# EasyEDA Pro project ProPrj_ch32v305_pico.epro, board PCB1_rev1
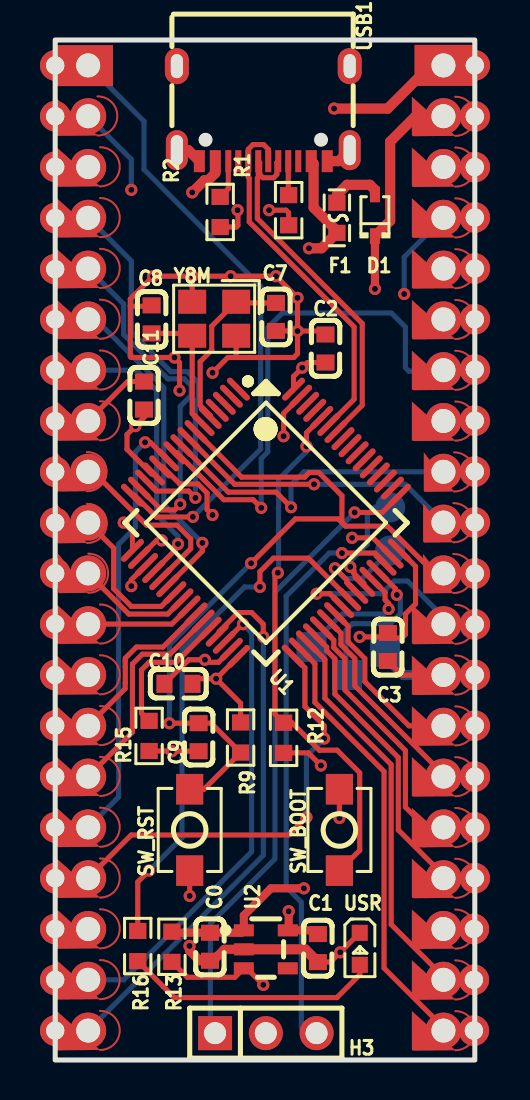
[diagram p11: board, top side]
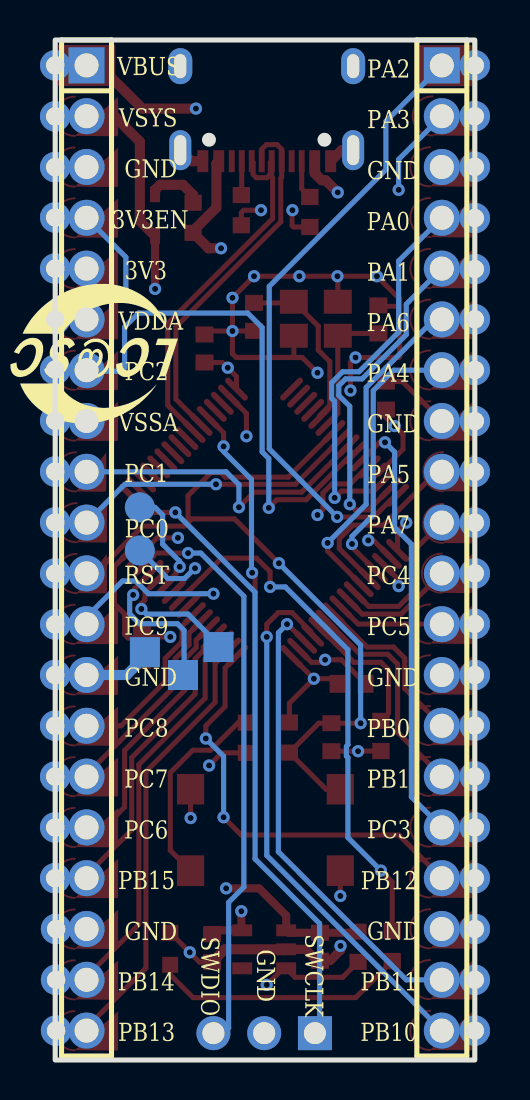
[diagram p12: board, bottom side, seen from below]

Outline 21 x 51 mm; copper layers: Top Layer, Inner1, Inner2, Bottom Layer. Coordinates in mm from the lower left corner of the outline.
Outline path: rectangle 0,51 21,0
Stack: Top Layer 0.035mm Outer layer thickness 1oz / Dielectric1 0.2104mm 7628 RC49% 8.6mil / Inner1 0.0152mm Inner layer thickness / Dielectric2 1.065mm 1.1mm H/HOZ Copper / Inner2 0.0152mm Inner layer thickness / Dielectric3 0.2104mm 7628 RC49% 8.6mil / Bottom Layer 0.035mm Outer layer thickness 1oz

## Design rules (mm)
net D-: DP1
net D+: DP1
spacing copperThickness1oz: track to track 0.102, other pairs 0.152 to 0.3
spacing copperThickness2oz: track to track 0.203, other pairs 0.152 to 0.3
spacing nothing (default): track to track 0.102, other pairs 0 to 0.3
track width copperThickness1oz (default): min 0.127, default 0.254, max 2.54
track width copperThickness2oz: min 0.203, default 0.254, max 2.54
track width powerRail: min 0.254, default 0.406, max 2.54
differential pair differentialPair (default): width min 0.127, default 0.254, max 2.54; gap min 0.152, default 0.152
net GND uses copperRegion, copperThickness1oz
net VSYS uses powerRail
net VBUS uses powerRail

## Placement (name value [footprint] x y rotation side)
C0  2.2uF  [C0603]  7.75 5.66 90 top
C1  2.2uF  [C0603]  13.15 5.6 90 top
C2  0.1uF  [C0603]  13.53 35.57 270 top
C3  0.1uF  [C0603]  16.65 20.65 90 top
C7  10pF  [C0603]  11.05 37.15 270 top
C8  10pF  [C0603]  4.83 37.03 270 top
C9  1uF  [C0603]  7.18 16.14 270 top
C10  0.1uF  [C0603]  6.17 18.81 0 top
C11  0.1uF  [C0603]  4.45 33.22 270 top
D1  B5819WS  [SOD-323_L1.7-W1.3-LS2.5-FD]  16 42.24 270 top
F1  SMD0603-050-12  [F0603]  14.1 42.11 90 top
H1  -  [HDR-TH_20P-P2.54-V-M-1]  1.65 25.6 270 bottom
H2  -  [HDR-TH_20P-P2.54-V-M-1]  19.43 25.6 270 bottom
H3  -  [HDR-TH_3P-P2.54-V-M]  10.54 1.34 0 top
NOREF  -  [Pad_e74]  1.65 19.26 0 top
NOREF#2  -  [Pad_e59]  21 39.57 0 top
NOREF#3  -  [Pad_e34]  0 24.33 0 top
NOREF#4  -  [Pad_e35]  0 21.81 0 top
NOREF#5  -  [Pad_e56]  21 31.97 0 top
NOREF#6  -  [Pad_e26]  0 44.66 0 top
NOREF#7  -  [Pad_e44]  20.96 1.47 0 top
NOREF#8  -  [Pad_e79]  1.65 6.56 0 top
NOREF#9  -  [Pad_e97]  19.43 1.46 180 top
NOREF#10  -  [Pad_e45]  20.96 4.01 0 top
NOREF#11  -  [Pad_e31]  0 31.94 0 top
NOREF#12  -  [Pad_e93]  19.43 11.62 180 top
NOREF#13  -  [Pad_e39]  0 11.63 0 top
NOREF#14  -  [Pad_e62]  21 47.18 0 top
NOREF#15  -  [Pad_e30]  0 34.5 0 top
NOREF#16  -  [Pad_e61]  21 44.64 0 top
NOREF#17  -  [Pad_e83]  19.43 44.64 180 top
NOREF#18  -  [Pad_e103]  19.66 24.32 180 top
NOREF#19  -  [Pad_e38]  0 14.18 0 top
NOREF#20  -  [Pad_e70]  1.65 34.5 0 top
NOREF#21  -  [Pad_e98]  19.43 49.73 180 top
NOREF#22  -  [Pad_e60]  21 42.13 0 top
NOREF#23  -  [Pad_e99]  1.33 26.83 0 top
NOREF#24  -  [Pad_e47]  21 9.09 0 top
NOREF#25  -  [Pad_e54]  21 26.88 0 top
NOREF#26  -  [Pad_e64]  1.45 49.72 0 top
NOREF#27  -  [Pad_e80]  1.65 4.02 0 top
NOREF#28  -  [Pad_e869]  16.76 25.47 0 top
NOREF#29  -  [Pad_e78]  1.65 9.1 0 top
NOREF#30  -  [Pad_e50]  21 16.72 0 top
NOREF#31  -  [Pad_e52]  21 21.78 0 top
NOREF#32  -  [Pad_e868]  16.76 27.63 0 top
NOREF#33  -  [Pad_e40]  0 9.09 0 top
NOREF#34  -  [Pad_e82]  19.43 47.18 180 top
NOREF#35  -  [Pad_e42]  0 4.01 0 top
NOREF#36  -  [Pad_e81]  1.65 1.48 0 top
NOREF#37  -  [Pad_e43]  0 1.47 0 top
NOREF#38  -  [Pad_e36]  0 19.25 0 top
NOREF#39  -  [Pad_e91]  19.43 16.7 180 top
NOREF#40  -  [Pad_e87]  19.43 34.48 180 top
NOREF#41  -  [Pad_e65]  1.53 47.2 0 top
NOREF#42  -  [Pad_e76]  1.65 14.18 0 top
NOREF#43  -  [Pad_e55]  21 29.42 0 top
NOREF#44  -  [Pad_e102]  19.66 26.86 180 top
NOREF#45  -  [Pad_e73]  1.65 21.8 0 top
NOREF#46  -  [Pad_e33]  0 26.87 0 top
NOREF#47  -  [Pad_e68]  1.65 39.58 0 top
NOREF#48  -  [Pad_e29]  0 37.03 0 top
NOREF#49  -  [Pad_e95]  19.43 6.54 180 top
NOREF#50  -  [Pad_e46]  20.96 6.55 0 top
NOREF#51  -  [Pad_e77]  1.65 11.64 0 top
NOREF#52  -  [Pad_e53]  21 24.32 0 top
NOREF#53  -  [Pad_e90]  19.43 19.24 180 top
NOREF#54  -  [Pad_e57]  21 34.52 0 top
NOREF#55  -  [Pad_e51]  21 19.25 0 top
NOREF#56  -  [Pad_e92]  19.43 14.16 180 top
NOREF#57  -  [Pad_e84]  19.43 42.1 180 top
NOREF#58  -  [Pad_e94]  19.43 9.08 180 top
NOREF#59  -  [Pad_e85]  19.43 39.56 180 top
NOREF#60  -  [Pad_e75]  1.65 16.72 0 top
NOREF#61  -  [Pad_e100]  1.4 24.34 0 top
NOREF#62  -  [Pad_e96]  19.43 4 180 top
NOREF#63  -  [Pad_e86]  19.43 37.02 180 top
NOREF#64  -  [Pad_e89]  19.43 21.78 180 top
NOREF#65  -  [Pad_e41]  0 6.55 0 top
NOREF#66  -  [Pad_e820]  16.51 20.39 0 top
NOREF#67  -  [Pad_e24]  0 49.73 0 top
NOREF#68  -  [Pad_e101]  19.7 29.4 180 top
NOREF#69  -  [Pad_e28]  0 39.55 0 top
NOREF#70  -  [Pad_e818]  12.83 20.65 0 top
NOREF#71  -  [Pad_e37]  0 16.72 0 top
NOREF#72  -  [Pad_e58]  21 37.04 0 top
NOREF#73  -  [Pad_e25]  0 47.19 0 top
NOREF#74  -  [Pad_e71]  1.65 31.96 0 top
NOREF#75  -  [Pad_e69]  1.65 37.04 0 top
NOREF#76  -  [Pad_e72]  1.32 29.42 0 top
NOREF#77  -  [Pad_e48]  21 11.63 0 top
NOREF#78  -  [Pad_e27]  0 42.1 0 top
NOREF#79  -  [Pad_e819]  14.6 19.25 0 top
NOREF#80  -  [Pad_e67]  1.65 42.12 0 top
NOREF#81  -  [Pad_e66]  1.65 44.66 0 top
NOREF#82  -  [Pad_e88]  19.43 31.94 180 top
NOREF#83  -  [Pad_e49]  21 14.17 0 top
NOREF#84  -  [Pad_e63]  21 49.73 0 top
NOREF#85  -  [Pad_e32]  0 29.41 0 top
R1  5.1k  [R0603]  11.68 42.49 270 top
R2  5.1k  [R0603]  8.26 42.4 270 top
R9  10k  [R0603]  9.28 16.12 90 top
R12  10k  [R0603]  11.43 16.11 90 top
R13  100K  [R0603]  5.84 5.66 270 top
R15  10k  [R0603]  4.7 16.2 90 top
R16  1K  [R0603]  4.13 5.7 90 top
SW_BOOT  -  [Key_SMD_3x4x2]  14.22 11.5 90 top
SW_RST  -  [Key_SMD_3x4x2]  6.73 11.5 90 top
U1  CH32V305RBT6  [LQFP-64_L10.0-W10.0-P0.50-LS12.0-BL]  10.54 26.87 225 top
U2  AP2112K-3.3TRG1  [SOT-23-5_L2.9-W1.6-P0.95-LS2.8-BR]  10.54 5.53 180 top
USB1  TYPE-C 16PIN 2MD(073)  [USB-C-SMD_TYPE-C-16PIN-2MD-073]  10.41 47.32 180 top
USR  -  [LED_0603]  15.25 5.51 270 top
Y8M  8MHz  [CRYSTAL-SMD_4P-L3.2-W2.5-BL]  7.96 37.06 180 top

## Footprints (pads in the part's own frame, mm; a bottom-side part is the same pattern mirrored in y, then rotated)
C0603
  rect 0.8x0.9 smd: 1(-0.7,0) 2(0.7,0)
CRYSTAL-SMD_4P-L3.2-W2.5-BL
  rect 1.4x1.2 smd: 1(-1.1,-0.85) 2(1.1,-0.85) 3(1.1,0.85) 4(-1.1,0.85)
F0603
  rect 0.806x0.864 smd: 1(-0.753,0) 2(0.753,0)
HDR-TH_3P-P2.54-V-M
  rect 1.7x1.7 hole 1.1: 1(-2.54,0)
  round 1.7 hole 1.1: 2(0,0) 3(2.54,0)
HDR-TH_20P-P2.54-V-M-1
  rect 1.8x1.8 hole 1.2: 1(-24.13,0)
  round 1.8 hole 1.2: 2(-21.59,0) 3(-19.05,0) 4(-16.51,0) 5(-13.97,0) 6(-11.43,0) 7(-8.89,0) 8(-6.35,0) 9(-3.81,0) 10(-1.27,0) 11(1.27,0) 12(3.81,0) 13(6.35,0) 14(8.89,0) 15(11.43,0) 16(13.97,0) 17(16.51,0) 18(19.05,0) 19(21.59,0) 20(24.13,0)
Key_SMD_3x4x2
  rect 1.53x1.36 smd: 1(-2.035,0) 2(2.035,0)
LED_0603
  rect 0.8x0.8 smd: 1(-0.851,-0.01) 2(0.75,-0.005)
LQFP-64_L10.0-W10.0-P0.50-LS12.0-BL
  oval 0.3x1.5 smd: 1(-3.75,-5.688) 2(-3.25,-5.688) 3(-2.75,-5.688) 4(-2.25,-5.688) 5(-1.75,-5.688) 6(-1.25,-5.688) 7(-0.75,-5.688) 8(-0.25,-5.688) 9(0.25,-5.688) 10(0.75,-5.688) 11(1.25,-5.688) 12(1.75,-5.688) 13(2.25,-5.688) 14(2.75,-5.688) 15(3.25,-5.688) 16(3.75,-5.688) 33(3.75,5.688) 34(3.25,5.688) 35(2.75,5.688) 36(2.25,5.688) 37(1.75,5.688) 38(1.25,5.688) 39(0.75,5.688) 40(0.25,5.688) 41(-0.25,5.688) 42(-0.75,5.688) 43(-1.25,5.688) 44(-1.75,5.688) 45(-2.25,5.688) 46(-2.75,5.688) 47(-3.25,5.688) 48(-3.75,5.688)
  oval 1.5x0.3 smd: 17(5.7,-3.738) 18(5.7,-3.238) 19(5.7,-2.738) 20(5.7,-2.238) 21(5.7,-1.738) 22(5.7,-1.238) 23(5.7,-0.739) 24(5.7,-0.238) 25(5.7,0.262) 26(5.7,0.762) 27(5.7,1.262) 28(5.7,1.762) 29(5.7,2.261) 30(5.7,2.762) 31(5.7,3.261) 32(5.7,3.762) 49(-5.7,3.762) 50(-5.7,3.261) 51(-5.7,2.762) 52(-5.7,2.261) 53(-5.7,1.762) 54(-5.7,1.262) 55(-5.7,0.762) 56(-5.7,0.262) 57(-5.7,-0.238) 58(-5.7,-0.739) 59(-5.7,-1.238) 60(-5.7,-1.738) 61(-5.7,-2.238) 62(-5.7,-2.738) 63(-5.7,-3.238) 64(-5.7,-3.738)
Pad_e24
  round 1.524 hole 0.914: 1(0,0)
Pad_e25
  round 1.524 hole 0.914: 2(0,0)
Pad_e26
  round 1.524 hole 0.914: 3(0,0)
Pad_e27
  round 1.524 hole 0.914: 4(0,0)
Pad_e28
  round 1.524 hole 0.914: 5(0,0)
Pad_e29
  round 1.524 hole 0.914: 6(0,0)
Pad_e30
  round 1.524 hole 0.914: 7(0,0)
Pad_e31
  round 1.524 hole 0.914: 8(0,0)
Pad_e32
  round 1.524 hole 0.914: 9(0,0)
Pad_e33
  round 1.524 hole 0.914: 10(0,0)
Pad_e34
  round 1.524 hole 0.914: 11(0,0)
Pad_e35
  round 1.524 hole 0.914: 12(0,0)
Pad_e36
  round 1.524 hole 0.914: 13(0,0)
Pad_e37
  round 1.524 hole 0.914: 14(0,0)
Pad_e38
  round 1.524 hole 0.914: 15(0,0)
Pad_e39
  round 1.524 hole 0.914: 16(0,0)
Pad_e40
  round 1.524 hole 0.914: 17(0,0)
Pad_e41
  round 1.524 hole 0.914: 18(0,0)
Pad_e42
  round 1.524 hole 0.914: 19(0,0)
Pad_e43
  round 1.524 hole 0.914: 20(0,0)
Pad_e44
  round 1.524 hole 0.914: 1(0,0)
Pad_e45
  round 1.524 hole 0.914: 2(0,0)
Pad_e46
  round 1.524 hole 0.914: 3(0,0)
Pad_e47
  round 1.524 hole 0.914: 1(0,0)
Pad_e48
  round 1.524 hole 0.914: 2(0,0)
Pad_e49
  round 1.524 hole 0.914: 3(0,0)
Pad_e50
  round 1.524 hole 0.914: 4(0,0)
Pad_e51
  round 1.524 hole 0.914: 5(0,0)
Pad_e52
  round 1.524 hole 0.914: 6(0,0)
Pad_e53
  round 1.524 hole 0.914: 7(0,0)
Pad_e54
  round 1.524 hole 0.914: 8(0,0)
Pad_e55
  round 1.524 hole 0.914: 9(0,0)
Pad_e56
  round 1.524 hole 0.914: 10(0,0)
Pad_e57
  round 1.524 hole 0.914: 11(0,0)
Pad_e58
  round 1.524 hole 0.914: 12(0,0)
Pad_e59
  round 1.524 hole 0.914: 13(0,0)
Pad_e60
  round 1.524 hole 0.914: 14(0,0)
Pad_e61
  round 1.524 hole 0.914: 15(0,0)
Pad_e62
  round 1.524 hole 0.914: 16(0,0)
Pad_e63
  round 1.524 hole 0.914: 17(0,0)
Pad_e64
  custom 2.891x2.05 smd: 65(0,0)
Pad_e65
  custom 3.159x1.975 smd: 66(0,0)
Pad_e66
  custom 3.158x1.975 smd: 66(0,0)
Pad_e67
  custom 3.158x1.975 smd: 66(0,0)
Pad_e68
  custom 3.158x1.975 smd: 66(0,0)
Pad_e69
  custom 3.158x1.975 smd: 66(0,0)
Pad_e70
  custom 3.158x1.975 smd: 66(0,0)
Pad_e71
  custom 3.158x1.975 smd: 66(0,0)
Pad_e72
  custom 2.502x1.975 smd: 66(0,0)
Pad_e73
  custom 3.158x1.975 smd: 66(0,0)
Pad_e74
  custom 3.158x1.975 smd: 66(0,0)
Pad_e75
  custom 3.158x1.975 smd: 66(0,0)
Pad_e76
  custom 3.158x1.975 smd: 66(0,0)
Pad_e77
  custom 3.158x1.975 smd: 66(0,0)
Pad_e78
  custom 3.158x1.975 smd: 66(0,0)
Pad_e79
  custom 3.158x1.975 smd: 66(0,0)
Pad_e80
  custom 3.158x1.975 smd: 66(0,0)
Pad_e81
  custom 3.158x1.975 smd: 66(0,0)
Pad_e82
  custom 3.158x1.975 smd: 66(0,0)
Pad_e83
  custom 3.158x1.975 smd: 66(0,0)
Pad_e84
  custom 3.158x1.975 smd: 66(0,0)
Pad_e85
  custom 3.158x1.975 smd: 66(0,0)
Pad_e86
  custom 3.158x1.975 smd: 66(0,0)
Pad_e87
  custom 3.158x1.975 smd: 66(0,0)
Pad_e88
  custom 3.158x1.975 smd: 66(0,0)
Pad_e89
  custom 3.158x1.975 smd: 66(0,0)
Pad_e90
  custom 3.158x1.975 smd: 66(0,0)
Pad_e91
  custom 3.158x1.975 smd: 66(0,0)
Pad_e92
  custom 3.158x1.975 smd: 66(0,0)
Pad_e93
  custom 3.158x1.975 smd: 66(0,0)
Pad_e94
  custom 3.158x1.975 smd: 66(0,0)
Pad_e95
  custom 3.158x1.975 smd: 66(0,0)
Pad_e96
  custom 3.158x1.975 smd: 66(0,0)
Pad_e97
  custom 3.158x1.975 smd: 66(0,0)
Pad_e98
  custom 2.892x2.051 smd: 65(0,0)
Pad_e99
  custom 2.502x1.975 smd: 66(0,0)
Pad_e100
  custom 2.502x1.975 smd: 66(0,0)
Pad_e101
  custom 2.502x1.975 smd: 66(0,0)
Pad_e102
  custom 2.502x1.975 smd: 66(0,0)
Pad_e103
  custom 2.502x1.975 smd: 66(0,0)
Pad_e818
  rect 1.5x1.5 smd far side: TP6(0,0)
Pad_e819
  rect 1.5x1.5 smd far side: TP7(0,0)
Pad_e820
  rect 1.5x1.5 smd far side: TP8(0,0)
Pad_e868
  round 1.5 smd far side: TP9(0,0)
Pad_e869
  round 1.5 smd far side: TP10(0,0)
R0603
  rect 0.806x0.864 smd: 1(-0.753,0) 2(0.753,0)
SOD-323_L1.7-W1.3-LS2.5-FD
  rect 0.78x0.5 smd: 1(-1.04,0) 2(1.04,0)
SOT-23-5_L2.9-W1.6-P0.95-LS2.8-BR
  rect 1x0.6 smd: 1(1.1,-0.95) 2(1.1,0) 3(1.1,0.95) 4(-1.1,0.95) 5(-1.1,-0.95)
USB-C-SMD_TYPE-C-16PIN-2MD-073
  oval 1.1x2 hole 0.6x1.5: 13(-4.325,1.825) 14(4.325,1.825)
  oval 1.2x1.8 hole 0.6x1.2: 13(-4.325,-2.375) 14(4.325,-2.375)
  rect 0.55x1.1 smd: A1B12(-3.2,2.375) A4B9(-2.4,2.375) B1A12(3.2,2.375) B4A9(2.4,2.375)
  rect 0.3x1.1 smd: A5(-1.25,2.375) A6(-0.25,2.375) A7(0.25,2.375) A8(1.25,2.375) B5(1.75,2.375) B6(0.75,2.375) B7(-0.75,2.375) B8(-1.75,2.375)

## Nets
3V3_EN: H2.4 NOREF#22.14 NOREF#57.66 R13.2 U2.3
+3.3V: C1.2 C2.2 C3.2 C10.2 C11.2 H2.5 H2.6 NOREF#2.13 NOREF#59.66 NOREF#63.66 NOREF#72.12 R9.2 SW_BOOT.2 U1.13 U1.19 U1.32 U1.48 U1.64 U2.5
GND: C0.1 C1.1 C2.1 C3.1 C7.2 C8.1 C9.2 C10.1 C11.1 H1.3 H1.8 H1.13 H1.18 H2.3 H2.8 H2.13 H2.18 H3.2 NOREF.66 NOREF#5.10 NOREF#6.3 NOREF#8.66 NOREF#11.8 NOREF#16.15 NOREF#17.66 NOREF#38.13 NOREF#49.66 NOREF#50.3 NOREF#53.66 NOREF#55.5 NOREF#65.18 NOREF#66.TP8 NOREF#74.66 NOREF#81.66 NOREF#82.66 R1.2 R2.2 R12.1 R15.1 SW_RST.1 U1.12 U1.18 U1.31 U1.47 U1.63 U2.2 USB1.13 USB1.14 USB1.A1B12 USB1.B1A12 USR.1 Y8M.2 Y8M.4
VBUS: F1.1 H2.1 NOREF#21.65 NOREF#84.17 USB1.A4B9 USB1.B4A9
BOOT0: R12.2 SW_BOOT.1 U1.60
D+: U1.59 USB1.A6 USB1.B6
D-: U1.58 USB1.A7 USB1.B7
OSC_IN: C7.1 U1.5 Y8M.1
OSC_OUT: C8.2 U1.6 Y8M.3
PA0: H1.4 NOREF#78.4 NOREF#80.66 U1.14
PA1: H1.5 NOREF#47.66 NOREF#69.5 U1.15
PA2: H1.1 NOREF#26.65 NOREF#67.1 U1.16
PA3: H1.2 NOREF#41.66 NOREF#73.2 U1.17
PA4: H1.7 NOREF#15.7 NOREF#20.66 U1.20
PA5: H1.9 NOREF#76.66 NOREF#85.9 U1.21
PA6: H1.6 NOREF#48.6 NOREF#75.66 U1.22
PA7: H1.10 NOREF#23.66 NOREF#46.10 U1.23
PA8: R16.2 U1.41
PA9: NOREF#28.TP10 U1.42
PA10: NOREF#32.TP9 U1.43
PA15: U1.50
PB0: H1.14 NOREF#60.66 NOREF#71.14 U1.26
PB1: H1.15 NOREF#19.15 NOREF#42.66 U1.27
PB2: R15.2 U1.28
PB3: U1.55
PB4: U1.56
PB5: U1.57
PB8: U1.61
PB9: U1.62
PB10: H1.20 NOREF#36.66 NOREF#37.20 U1.29
PB11: H1.19 NOREF#27.66 NOREF#35.19 U1.30
PB12: H1.17 NOREF#29.66 NOREF#33.17 U1.33
PB13: H2.20 NOREF#7.1 NOREF#9.66 U1.34
PB14: H2.19 NOREF#10.2 NOREF#62.66 U1.35
PB15: H2.17 NOREF#24.1 NOREF#58.66 U1.36
PC0: H2.10 NOREF#25.8 NOREF#44.66 U1.8
PC1: H2.9 NOREF#43.9 NOREF#68.66 U1.9
PC2: H2.7 NOREF#40.66 NOREF#54.11 U1.10
PC3: H1.16 NOREF#13.16 NOREF#51.66 U1.11
PC4: H1.11 NOREF#3.11 NOREF#61.66 U1.24
PC5: H1.12 NOREF#4.12 NOREF#45.66 U1.25
PC6: H2.16 NOREF#12.66 NOREF#77.2 U1.37
PC7: H2.15 NOREF#56.66 NOREF#83.3 U1.38
PC8: H2.14 NOREF#30.4 NOREF#39.66 U1.39
PC9: H2.12 NOREF#31.6 NOREF#64.66 U1.40
PC10: U1.51
PC11: U1.52
PC12: U1.53
PC13: U1.2
PC14: U1.3
PC15: U1.4
PD2: U1.54
SWCLK: H3.1 U1.49
SWDIO: H3.3 U1.46
SYS_RST: C9.1 H2.11 NOREF#18.66 NOREF#52.7 R9.1 SW_RST.2 U1.7
USB1DM: NOREF#70.TP6 U1.44
USB1DP: NOREF#79.TP7 U1.45
VSYS: C0.2 D1.2 H2.2 NOREF#14.16 NOREF#34.66 R13.1 U2.1
$1N10: R1.1 USB1.A5
$1N11: R2.1 USB1.B5
$1N150: D1.1 F1.2
$1N168: R16.1 USR.2

Pads without a net: U1 1; U2 4; USB1 A8 B8

## Via types
v1: diameter 0.61, hole 0.305, Top Layer to Bottom Layer, 63 vias

## Routing (per net, layer and track width the routed paths; a pad name or vN(x,y) marks a point on that pad's centre or on a via; arc(x,y) is an arc through that point)
3V3_EN: length 50.9
  Top Layer w0.254: R13.2 6.61,4.14 8.99,4.14 U2.3 9.59,4.58 v1(10.41,3.76)
  Inner2 w0.254: v1(10.41,3.76) 15.75,3.76 17.78,5.79 17.78,37.98 v1(17.46,38.3)
  Bottom Layer w0.254: v1(17.46,38.3) 17.46,40.14 H2.4
+3.3V: length 91.8
  Top Layer w0.254: C11.2 4.45,32.13 v1(4.01,31.7) 3.59,31.28 3.59,30.53 4.83,29.3 4.93,29.3 ; 9.28,16.88 9.28,17.84 v1(8.05,19.06) ; v1(3.81,23.69) 3.81,24.01 U1.19 ; v1(15.24,21.16) 16.45,21.16 C3.2 16.9,21.1 17.35,21.1 17.53,21.28 17.53,22.3 18.03,22.81 18.03,24.68 17.22,25.5 ; U1.32 v1(8.05,19.06) ; v1(8.05,19.06) 6.87,19.06 ; C1.2 13.4,6.3 ; v1(14.22,12.1) SW_BOOT.2 ; C2.2 12.62,34.87 v1(12.36,34.61) 11.93,34.18 U1.64
  Top Layer w0.406: 13.4,6.3 13.21,6.48 U2.5 11.68,6.53 v1(11.68,7.44)
  Inner2 w0.254: v1(15.24,21.16) 15.11,21.03 12.7,21.03 11.68,20.01 ; v1(8.05,19.06) 11.62,19.06 11.68,19.12 ; 9.14,31.7 9.09,31.75 4.06,31.75 4.01,31.7 ; 9.14,23.82 3.94,23.82 v1(3.81,23.69) ; 11.68,11.63 11.76,11.55 12.81,11.55 13.36,12.1 v1(14.22,12.1)
  Inner2 w0.406: H2.6 18.12,38.34 18.12,39.57 ; 18.12,39.57 15.39,39.57 14.99,39.16 14.99,35.63 13.97,34.61 v1(12.36,34.61) 9.72,34.61 9.14,34.04 9.14,23.82 11.68,21.28 v1(11.68,7.44) ; 18.12,39.57 H2.5
GND: length 76
  Top Layer w0.254: 9.01,35.12 8.64,35.12 v1(7.87,34.36) ; 9.01,35.12 11.94,35.12 12.13,35.32 v1(12.13,36.45) ; 9.01,35.12 9.06,35.17 9.06,36.21 ; v1(13.3,14.72) 12.67,15.36 R12.1 ; C7.2 12.12,36.45 v1(12.13,36.45) ; R15.1 5.83,15.45 v1(5.84,15.44) C9.2 ; v1(12.13,36.45) v1(12.13,38.11) v1(11.05,39.19) v1(8.78,39.19) 6.72,39.19 ; v1(12.13,36.45) 13.35,36.45 C2.1 ; NOREF#53.66 17.36,19.24 C3.1 ; 16.86,25.15 15.9,26.11 v1(14.86,26.11) ; v1(11.43,31.19) 11.43,32.33 12.28,33.18 U1.63 ; v1(5.33,25.98) 5.07,25.98 4.22,25.13 ; H1.8 3.62,33.92 C11.1 ; v1(6.73,8.2) SW_RST.1 ; 3.76,37.69 3.76,38.05 v1(4.9,39.19) 6.72,39.19 ; 3.76,37.69 3.76,35.18 3.81,35.12 v1(5.97,35.12) 6.22,34.87 v1(6.22,33.47) ; 3.76,37.69 4.78,37.69 C8.1 ; 6.72,39.19 6.86,39.05 Y8M.2 ; 8.82,20.53 8.17,19.89 7.62,19.89 v1(7.49,20.01) 6.68,20.01 6.19,19.53 6.19,19.53 C10.1 ; v1(7.87,27.25) 7.6,27.53 7.6,28.35 7.15,28.8 6.23,28.8 5.38,29.65 U1.12 ; v1(9.13,42.49) 9.14,42.47 9.14,41.73 9.06,41.65 R2.2 ; v1(10.7,42.49) 11.56,42.49 11.68,42.36 R1.2 ; USR.1 v1(14.27,5.39) 13.78,4.9 C1.1
  Top Layer w0.457: 7.24,4.96 6.72,5.48 v1(6.72,5.7) ; C0.1 7.9,4.96 8.47,5.53 U2.2
  Top Layer w0.508: 14.74,45.49 14.19,44.94 USB1.A1B12 ; U2.2 12.51,5.53 C1.1 ; USB1.14 6.66,45.49 USB1.B1A12
  Bottom Layer w0.508: 16.25,20.43 17.42,19.25 H2.13
  vias: v1(6.88,39.19)
VBUS: length 31.2
  Top Layer w0.508: v1(13.96,47.57) 16.64,47.57 18.8,49.73 NOREF#21.65 ; USB1.A4B9 12.93,44.82 12.93,42.62 14.1,41.45 F1.1 13.33,40.59 v1(12.7,40.59) ; USB1.B4A9 8.01,44.34 7.66,43.99 7.46,43.99 v1(6.86,43.38)
  Inner2 w0.508: v1(13.96,47.57) 12.7,47.57 11.81,46.68 ; 11.75,40.59 v1(12.7,40.59) ; 11.75,40.59 11.75,46.68 ; 11.75,40.59 7.62,40.59 6.86,41.35 v1(6.86,43.38)
BOOT0: length 26.6
  Top Layer w0.254: SW_BOOT.1 15.24,10.48 15.24,14.36 14.11,15.49 13.22,15.49 11.85,16.86 R12.2 11,17.3 11,24.22 v1(11.14,24.36) ; v1(12.57,30.68) 12.57,31.36 U1.60
  Bottom Layer w0.254: v1(11.14,24.36) 11.18,24.39 11.18,29.03 12.57,30.43 v1(12.57,30.68)
D+: length 18.3
  Top Layer w0.254: USB1.A6 10.67,44.95 10.67,45.53 10.43,45.77 9.9,45.77 9.66,45.54 USB1.B6 9.66,44.14 9.71,44.09 9.71,41.91 14.96,36.66 14.96,33.04 U1.59
D-: length 18.6
  Top Layer w0.254: USB1.B7 11.09,44.87 11.09,44.28 10.93,44.11 10.4,44.11 10.24,44.28 10.24,44.87 USB1.A7 10.16,44.14 10.12,44.09 10.12,42.07 15.37,36.83 15.37,32.74 U1.58
OSC_IN: length 8.8
  Top Layer w0.254: U1.5 7.76,32.23 7.26,32.73 7.26,34.92 7.84,35.5 7.84,36.69 Y8M.1 9.12,37.85 C7.1
OSC_OUT: length 6.7
  Top Layer w0.254: U1.6 6.86,32.32 6.86,36.21 6.74,36.33 C8.2
PA0: length 19.6
  Top Layer w0.254: U1.14 5.07,28.45 6.68,28.45 v1(7.02,28.11)
  Bottom Layer w0.254: H1.4 3.81,39.95 3.81,36.39 5.79,34.41 6.61,34.41 7.16,33.86 7.16,33.08 7.02,32.94 v1(7.02,28.11)
PA1: length 17.2
  Top Layer w0.254: v1(6.26,27.79) 5.98,27.5 5.31,27.5 U1.15
  Bottom Layer w0.254: v1(6.26,27.79) 6.26,32.68 6.81,33.23 6.81,33.72 6.47,34.06 5.64,34.06 3.43,36.27 3.43,37.79 H1.5
PA2: length 31
  Top Layer w0.254: v1(6.89,27.16) 6.88,27.15 5.06,27.15 3.97,28.24 U1.16
  Bottom Layer w0.254: v1(6.89,27.16) 10.29,30.55 10.29,38.68 4.44,44.52 4.44,46.94 H1.1
PA3: length 22.9
  Top Layer w0.254: v1(3.43,26.87) 3.87,26.43 3.87,25.48
  Inner2 w0.254: v1(3.43,26.87) 3.43,43.13 v1(3.81,43.51)
  Bottom Layer w0.254: H1.2 3.81,45.03 v1(3.81,43.51)
PA4: length 13.8
  Top Layer w0.254: U1.20 6.15,25.64 v1(6.15,25.8)
  Bottom Layer w0.254: H1.7 4.06,34.49 5.08,33.47 5.08,27.25 6.15,26.18 v1(6.15,25.8)
PA5: length 9.1
  Top Layer w0.254: H1.9 1.91,29.41 4.57,26.74 6.1,26.74 6.78,26.06 6.78,25.57 U1.21
PA6: length 16.6
  Top Layer w0.254: 5.63,23.72 7.37,25.45 v1(7.37,25.85)
  Bottom Layer w0.254: v1(7.37,25.85) 5.44,27.78 5.44,33.62 2.03,37.03 H1.6
PA7: length 7.6
  Top Layer w0.254: H1.10 2.93,25.59 2.93,23.95 2.92,23.94 2.92,23.57 3.81,22.68 5.31,22.68 U1.23
PA8: length 26.6
  Top Layer w0.254: U1.41 12.67,25.09 10.92,25.09 10.25,24.42 v1(10.25,23.65) ; v1(4.7,9.47) 4.13,8.9 R16.2
  Bottom Layer w0.254: v1(4.7,9.47) 6.35,11.12 6.35,15.12 6.43,15.2 6.43,15.68 6.35,15.76 6.35,20.52 9.48,23.65 v1(10.25,23.65)
PA9: length 5.3
  Top Layer w0.254: U1.42 14.59,23.88 14.59,24 v1(14,24.59)
  Bottom Layer w0.254: 16.76,25.6 NOREF#28.TP10 15.37,24.07 14.53,24.07 14.01,24.59 v1(14,24.59)
PA10: length 5.6
  Top Layer w0.254: v1(14.77,24.66) 14.95,24.48 14.95,24.33 15.45,23.83 15.45,23.73
  Bottom Layer w0.254: v1(14.77,24.66) 14.77,24.94 15.62,25.79 15.62,27.25 16,27.63 16.38,27.63 16.76,28.01
PB0: length 8.6
  Top Layer w0.254: 7.05,22.3 5.4,20.65 4.06,20.65 3.51,20.09 3.51,19.95 3.5,19.95 3.5,19.65 3.51,19.65 3.51,18.87 3.5,18.87 3.5,18.57 NOREF#60.66
PB1: length 11
  Top Layer w0.254: NOREF#42.66 3.87,16.39 3.87,19.79 4.36,20.29 5.75,20.29 U1.27
PB2: length 7
  Top Layer w0.254: R15.2 4.32,17.34 4.32,19.5 4.7,19.89 6.05,19.89 U1.28
PB10: length 27
  Top Layer w0.254: U1.29 8.21,21.34 8.21,21.43 9.16,22.37 9.83,22.37 10.41,21.79 v1(10.41,21.16)
  Bottom Layer w0.254: v1(10.41,21.16) 10.41,10.23 H1.20
PB11: length 23.7
  Top Layer w0.254: U1.30 9.37,21.79 v1(9.4,21.79)
  Bottom Layer w0.254: v1(9.4,21.79) 9.83,21.36 9.83,10.41 3.43,4.01 H1.19
PB12: length 21.3
  Top Layer w0.254: v1(13.46,16.08) 13.46,16.71 12.5,17.67 12.5,19.61 U1.33 ; NOREF#29.66 3.8,11.25 11.68,11.25 v1(12.57,12.14)
  Bottom Layer w0.254: v1(13.46,16.08) 12.57,15.19 v1(12.57,12.14)
PB13: length 22
  Top Layer w0.254: H2.20 19.43,1.62 16.46,4.59 16.46,14.42 13,17.88 13,19.82 U1.34
PB14: length 19.7
  Top Layer w0.254: NOREF#62.66 19.43,4.16 16.81,6.78 16.81,14.77 13.5,18.09 13.5,20.02 U1.35
PB15: length 14.8
  Top Layer w0.254: NOREF#58.66 19.43,9.24 17.17,11.5 17.17,15.12 14,18.3 14,20.06 13.59,20.47 13.59,20.64 U1.36
PC0: length 14.5
  Top Layer w0.254: U1.8 8.98,28.79 v1(12.95,28.79)
  Bottom Layer w0.254: H2.10 17.51,28.79 v1(12.95,28.79)
PC1: length 15.8
  Top Layer w0.254: v1(11.8,27.64) 11.05,28.39 8.66,28.39 U1.9
  Bottom Layer w0.254: H2.9 12.45,29.41 11.8,28.77 v1(11.8,27.64)
PC2: length 26.1
  Top Layer w0.254: v1(10.31,27.61) 9.91,28.01 8.44,28.01 6.09,30.36 U1.10
  Bottom Layer w0.254: H2.7 19.38,34.44 17.71,34.44 17.53,34.62 17.53,36.65 16.83,37.35 11.37,37.35 10.64,36.62 10.64,30.41 10.31,30.07 v1(10.31,27.61)
PC3: length 21.9
  Top Layer w0.254: v1(4.5,30.88) 4.76,30.88 U1.11
  Bottom Layer w0.254: H1.16 3.18,13.15 3.18,25.79 4.01,26.63 4.01,30.4 v1(4.5,30.88)
PC4: length 5.8
  Top Layer w0.254: H1.11 3.68,22.3 5.63,22.3 U1.24
PC5: length 5.4
  Top Layer w0.254: NOREF#45.66 5.84,21.8 U1.25
PC6: length 13
  Top Layer w0.254: H2.16 18.54,11.63 17.53,12.65 17.53,15.47 14.5,18.5 14.5,20.06 13.94,20.62 13.94,20.99 U1.37
PC7: length 10.2
  Top Layer w0.254: NOREF#56.66 19.43,14.28 15,18.71 15,20.07 14.3,20.77 14.3,21.34 U1.38
PC8: length 8.9
  Top Layer w0.254: H2.14 17.7,16.71 15.5,18.92 15.5,20.07 14.66,20.91 14.66,21.69 U1.39
PC9: length 9.3
  Top Layer w0.254: U1.40 13.74,23.31 v1(13.08,23.31)
  Bottom Layer w0.254: v1(13.08,23.31) 16.33,23.31 16.97,23.95 17.63,23.95 19.43,22.15 H2.12
SWCLK: length 31.7
  Top Layer w0.254: v1(14.99,27.38) 16.37,27.38 U1.49
  Bottom Layer w0.254: v1(14.99,27.38) 11,23.39 11,10.06 7.77,6.82 7.77,1.58 H3.1
SWDIO: length 28.9
  Top Layer w0.254: v1(14.35,25.35) 16,25.35 16.51,24.84 U1.46
  Bottom Layer w0.254: H3.3 12.57,1.34 12.32,1.6 12.32,7.88 11.56,8.64 11.56,23.19 13.72,25.35 v1(14.35,25.35)
SYS_RST: length 39
  Top Layer w0.254: 14.35,26.87 14.17,27.06 12.02,27.06 v1(9.8,24.84) ; 14.35,26.87 14.35,28.22 13.2,29.37 12.71,29.37 12.48,29.14 9.33,29.14 7.05,31.42 ; 14.35,26.87 14.53,26.69 16.63,26.69 18.99,24.33 H2.11 ; v1(5.72,16.84) 5.72,16.84 C9.1 7.81,16.84 R9.1 7.45,13.54 SW_RST.2
  Bottom Layer w0.254: v1(9.8,24.84) 5.72,20.75 v1(5.72,16.84)
USB1DM: length 6.6
  Top Layer w0.254: v1(16.69,22.55) 16.69,22.83 16.51,23.01 16.51,23.38 U1.44
  Bottom Layer w0.254: NOREF#70.TP6 12.83,20.77 14.35,22.3 16.43,22.3 v1(16.69,22.55)
USB1DP: length 7.5
  Top Layer w0.254: 16.15,24.44 17.02,23.58 17.02,23.34 v1(17.1,23.25)
  Bottom Layer w0.254: v1(17.1,23.25) 17.1,23.22 17.27,23.05 17.27,22.31 16.78,21.81 14.88,21.81 14.55,21.48 14.55,19.71 14.53,19.71 14.48,19.76
VSYS: length 52
  Top Layer w0.406: v1(12.45,8.58) 10.79,8.58 9.44,7.23 U2.1 9.32,6.36 C0.2 5.89,6.36 R13.1 ; D1.2 v1(16,38.55)
  Top Layer w0.508: NOREF#34.66 18.03,47.18 16.76,45.92 16.76,41.96 D1.2
  Inner2 w0.457: v1(12.45,8.58) 15.37,8.58 16,9.22 v1(16,38.55)
$1N10: length 1.7
  Top Layer w0.254: R1.1 11.66,43.26 USB1.A5
$1N11: length 2
  Top Layer w0.254: R2.1 8.66,43.56 USB1.B5
$1N150: length 2.8
  Top Layer w0.508: F1.2 14.1,43.25 14.6,43.76 15.75,43.76 16,43.51 D1.1
$1N168: length 12.8
  Top Layer w0.254: USR.2 15.25,4.27 14.1,3.12 5.96,3.12 4.13,4.95

## Copper pours and planes (outline as drawn; the poured copper is in the pictures)
GND on Inner1: 0,51 21,51 21,0 0,0

## Text on the board
Bottom Silkscreen Layer: PA2 | PA3 | GND | PC3 | PA5 | PC5 | PA1 | PB1 | PA7 | PA0 | PA6 | PB0 | PA4 | PC4 | PB12 | PB11 | PB10 | PC0 | 3V3 | PC2 | PC8 | PC1 | PC9 | PC7 | RST | PC6 | VSYS | VDDA | VSSA | PB13 | PB15 | PB14 | VBUS | 3V3EN | SWCLK | SWDIO
